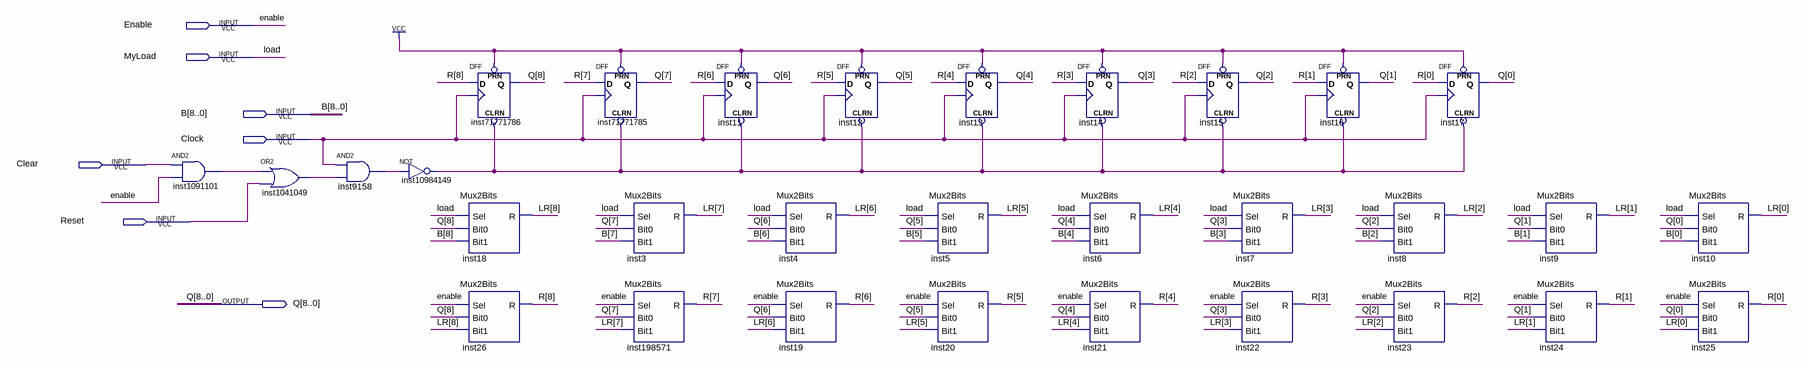
[diagram p0: schematic sheet]
// Quartus schematic Registrador.bdf as structural Verilog: 31 symbols, 7 pins
module Registrador (
  input  Enable,
  input  MyLoad,
  input  [8:0] B,
  input  Clock,
  input  Clear,
  input  Reset,
  output [8:0] Q
);

  wire inst9158_out, inst1041049_out, inst1091101_out, inst10984149_out;
  wire [8:0] LR, R;

  and inst1091101 (inst1091101_out, Clear, Enable);
  or inst1041049 (inst1041049_out, inst1091101_out, Reset);
  and inst9158 (inst9158_out, Clock, inst1041049_out);
  not inst10984149 (inst10984149_out, inst9158_out);
  DFF inst71771786 (.CLRN(inst10984149_out), .CLK(Clock), .D(R[8]), .PRN(1'b1), .Q(Q[8]));
  Mux2Bits inst18 (.Sel(MyLoad), .Bit0(Q[8]), .Bit1(B[8]), .R(LR[8]));
  Mux2Bits inst26 (.Sel(Enable), .Bit0(Q[8]), .Bit1(LR[8]), .R(R[8]));
  DFF inst71771785 (.CLRN(inst10984149_out), .CLK(Clock), .D(R[7]), .PRN(1'b1), .Q(Q[7]));
  Mux2Bits inst3 (.Sel(MyLoad), .Bit0(Q[7]), .Bit1(B[7]), .R(LR[7]));
  Mux2Bits inst198571 (.Sel(Enable), .Bit0(Q[7]), .Bit1(LR[7]), .R(R[7]));
  DFF inst11 (.CLRN(inst10984149_out), .CLK(Clock), .D(R[6]), .PRN(1'b1), .Q(Q[6]));
  Mux2Bits inst4 (.Sel(MyLoad), .Bit0(Q[6]), .Bit1(B[6]), .R(LR[6]));
  Mux2Bits inst19 (.Sel(Enable), .Bit0(Q[6]), .Bit1(LR[6]), .R(R[6]));
  DFF inst12 (.CLRN(inst10984149_out), .CLK(Clock), .D(R[5]), .PRN(1'b1), .Q(Q[5]));
  Mux2Bits inst5 (.Sel(MyLoad), .Bit0(Q[5]), .Bit1(B[5]), .R(LR[5]));
  Mux2Bits inst20 (.Sel(Enable), .Bit0(Q[5]), .Bit1(LR[5]), .R(R[5]));
  DFF inst13 (.CLRN(inst10984149_out), .CLK(Clock), .D(R[4]), .PRN(1'b1), .Q(Q[4]));
  DFF inst14 (.CLRN(inst10984149_out), .CLK(Clock), .D(R[3]), .PRN(1'b1), .Q(Q[3]));
  Mux2Bits inst6 (.Sel(MyLoad), .Bit0(Q[4]), .Bit1(B[4]), .R(LR[4]));
  Mux2Bits inst21 (.Sel(Enable), .Bit0(Q[4]), .Bit1(LR[4]), .R(R[4]));
  DFF inst15 (.CLRN(inst10984149_out), .CLK(Clock), .D(R[2]), .PRN(1'b1), .Q(Q[2]));
  Mux2Bits inst7 (.Sel(MyLoad), .Bit0(Q[3]), .Bit1(B[3]), .R(LR[3]));
  Mux2Bits inst22 (.Sel(Enable), .Bit0(Q[3]), .Bit1(LR[3]), .R(R[3]));
  DFF inst16 (.CLRN(inst10984149_out), .CLK(Clock), .D(R[1]), .PRN(1'b1), .Q(Q[1]));
  Mux2Bits inst8 (.Sel(MyLoad), .Bit0(Q[2]), .Bit1(B[2]), .R(LR[2]));
  Mux2Bits inst23 (.Sel(Enable), .Bit0(Q[2]), .Bit1(LR[2]), .R(R[2]));
  DFF inst17 (.CLRN(inst10984149_out), .CLK(Clock), .D(R[0]), .PRN(1'b1), .Q(Q[0]));
  Mux2Bits inst9 (.Sel(MyLoad), .Bit0(Q[1]), .Bit1(B[1]), .R(LR[1]));
  Mux2Bits inst24 (.Sel(Enable), .Bit0(Q[1]), .Bit1(LR[1]), .R(R[1]));
  Mux2Bits inst10 (.Sel(MyLoad), .Bit0(Q[0]), .Bit1(B[0]), .R(LR[0]));
  Mux2Bits inst25 (.Sel(Enable), .Bit0(Q[0]), .Bit1(LR[0]), .R(R[0]));

  // Other names for the same wires on the sheet: load = MyLoad
endmodule
